# Altium schematic sheet ModuleConnectorB.SchDoc
size A portrait; DocumentNumber: 1; SheetNumber: 2; SheetTotal: 24
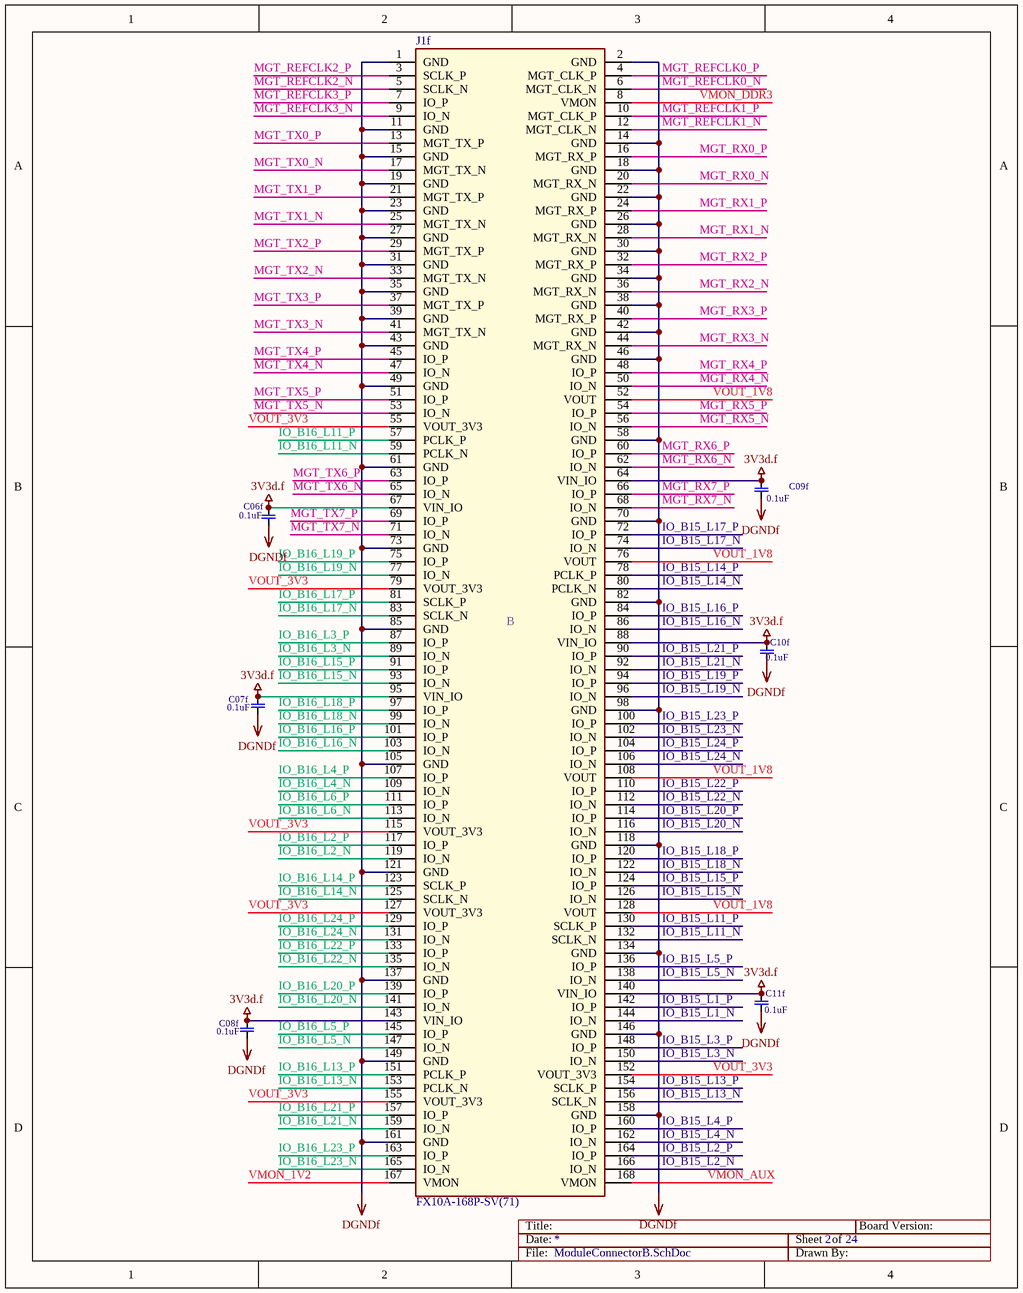
[diagram p0: ModuleConnectorB.SchDoc]

## Parts
C06f  0.1uF  [0603]
C07f  0.1uF  [0603]
C08f  0.1uF  [0603]
C09f  0.1uF  [0603]
C10f  0.1uF  [0603]
C11f  0.1uF  [0603]
J1f  FX10A-168P-SV(71)  [Mercury_Baseboard_Connector]

## Nets
3V3d.f: C06f.1 C07f.1 C08f.1 C09f.1 C10f.1 C11f.1 J1f.64(VIN_IO) J1f.67(VIN_IO) J1f.88(VIN_IO) J1f.95(VIN_IO) J1f.140(VIN_IO) J1f.143(VIN_IO)
DGNDf: C06f.2 C07f.2 C08f.2 C09f.2 C10f.2 C11f.2 J1f.1(GND) J1f.2(GND) J1f.11(GND) J1f.14(GND) J1f.15(GND) J1f.18(GND) J1f.19(GND) J1f.22(GND) J1f.23(GND) J1f.26(GND) J1f.27(GND) J1f.30(GND) J1f.31(GND) J1f.34(GND) J1f.35(GND) J1f.38(GND) J1f.39(GND) J1f.42(GND) J1f.43(GND) J1f.46(GND) J1f.49(GND) J1f.58(GND) J1f.61(GND) J1f.70(GND) J1f.73(GND) J1f.82(GND) J1f.85(GND) J1f.98(GND) J1f.105(GND) J1f.118(GND) J1f.121(GND) J1f.134(GND) J1f.137(GND) J1f.146(GND) J1f.149(GND) J1f.158(GND) J1f.161(GND)
IO_B15_L1_N: J1f.144(IO_N)
IO_B15_L1_P: J1f.142(IO_P)
IO_B15_L2_N: J1f.166(IO_N)
IO_B15_L2_P: J1f.164(IO_P)
IO_B15_L3_N: J1f.150(IO_N)
IO_B15_L3_P: J1f.148(IO_P)
IO_B15_L4_N: J1f.162(IO_N)
IO_B15_L4_P: J1f.160(IO_P)
IO_B15_L5_N: J1f.138(IO_N)
IO_B15_L5_P: J1f.136(IO_P)
IO_B15_L11_N: J1f.132(SCLK_N)
IO_B15_L11_P: J1f.130(SCLK_P)
IO_B15_L13_N: J1f.156(SCLK_N)
IO_B15_L13_P: J1f.154(SCLK_P)
IO_B15_L14_N: J1f.80(PCLK_N)
IO_B15_L14_P: J1f.78(PCLK_P)
IO_B15_L15_N: J1f.126(IO_N)
IO_B15_L15_P: J1f.124(IO_P)
IO_B15_L16_N: J1f.86(IO_N)
IO_B15_L16_P: J1f.84(IO_P)
IO_B15_L17_N: J1f.74(IO_N)
IO_B15_L17_P: J1f.72(IO_P)
IO_B15_L18_N: J1f.122(IO_N)
IO_B15_L18_P: J1f.120(IO_P)
IO_B15_L19_N: J1f.96(IO_N)
IO_B15_L19_P: J1f.94(IO_P)
IO_B15_L20_N: J1f.116(IO_N)
IO_B15_L20_P: J1f.114(IO_P)
IO_B15_L21_N: J1f.92(IO_N)
IO_B15_L21_P: J1f.90(IO_P)
IO_B15_L22_N: J1f.112(IO_N)
IO_B15_L22_P: J1f.110(IO_P)
IO_B15_L23_N: J1f.102(IO_N)
IO_B15_L23_P: J1f.100(IO_P)
IO_B15_L24_N: J1f.106(IO_N)
IO_B15_L24_P: J1f.104(IO_P)
IO_B16_L2_N: J1f.119(IO_N)
IO_B16_L2_P: J1f.117(IO_P)
IO_B16_L3_N: J1f.89(IO_N)
IO_B16_L3_P: J1f.87(IO_P)
IO_B16_L4_N: J1f.109(IO_N)
IO_B16_L4_P: J1f.107(IO_P)
IO_B16_L5_N: J1f.147(IO_N)
IO_B16_L5_P: J1f.145(IO_P)
IO_B16_L6_N: J1f.113(IO_N)
IO_B16_L6_P: J1f.111(IO_P)
IO_B16_L11_N: J1f.59(PCLK_N)
IO_B16_L11_P: J1f.57(PCLK_P)
IO_B16_L13_N: J1f.153(PCLK_N)
IO_B16_L13_P: J1f.151(PCLK_P)
IO_B16_L14_N: J1f.125(SCLK_N)
IO_B16_L14_P: J1f.123(SCLK_P)
IO_B16_L15_N: J1f.93(IO_N)
IO_B16_L15_P: J1f.91(IO_P)
IO_B16_L16_N: J1f.103(IO_N)
IO_B16_L16_P: J1f.101(IO_P)
IO_B16_L17_N: J1f.83(SCLK_N)
IO_B16_L17_P: J1f.81(SCLK_P)
IO_B16_L18_N: J1f.99(IO_N)
IO_B16_L18_P: J1f.97(IO_P)
IO_B16_L19_N: J1f.77(IO_N)
IO_B16_L19_P: J1f.75(IO_P)
IO_B16_L20_N: J1f.141(IO_N)
IO_B16_L20_P: J1f.139(IO_P)
IO_B16_L21_N: J1f.159(IO_N)
IO_B16_L21_P: J1f.157(IO_P)
IO_B16_L22_N: J1f.135(IO_N)
IO_B16_L22_P: J1f.133(IO_P)
IO_B16_L23_N: J1f.165(IO_N)
IO_B16_L23_P: J1f.163(IO_P)
IO_B16_L24_N: J1f.131(IO_N)
IO_B16_L24_P: J1f.129(IO_P)
MGT_REFCLK0_N: J1f.6(MGT_CLK_N)
MGT_REFCLK0_P: J1f.4(MGT_CLK_P)
MGT_REFCLK1_N: J1f.12(MGT_CLK_N)
MGT_REFCLK1_P: J1f.10(MGT_CLK_P)
MGT_REFCLK2_N: J1f.5(SCLK_N)
MGT_REFCLK2_P: J1f.3(SCLK_P)
MGT_REFCLK3_N: J1f.9(IO_N)
MGT_REFCLK3_P: J1f.7(IO_P)
MGT_RX0_N: J1f.20(MGT_RX_N)
MGT_RX0_P: J1f.16(MGT_RX_P)
MGT_RX1_N: J1f.28(MGT_RX_N)
MGT_RX1_P: J1f.24(MGT_RX_P)
MGT_RX2_N: J1f.36(MGT_RX_N)
MGT_RX2_P: J1f.32(MGT_RX_P)
MGT_RX3_N: J1f.44(MGT_RX_N)
MGT_RX3_P: J1f.40(MGT_RX_P)
MGT_RX4_N: J1f.50(IO_N)
MGT_RX4_P: J1f.48(IO_P)
MGT_RX5_N: J1f.56(IO_N)
MGT_RX5_P: J1f.54(IO_P)
MGT_RX6_N: J1f.62(IO_N)
MGT_RX6_P: J1f.60(IO_P)
MGT_RX7_N: J1f.68(IO_N)
MGT_RX7_P: J1f.66(IO_P)
MGT_TX0_N: J1f.17(MGT_TX_N)
MGT_TX0_P: J1f.13(MGT_TX_P)
MGT_TX1_N: J1f.25(MGT_TX_N)
MGT_TX1_P: J1f.21(MGT_TX_P)
MGT_TX2_N: J1f.33(MGT_TX_N)
MGT_TX2_P: J1f.29(MGT_TX_P)
MGT_TX3_N: J1f.41(MGT_TX_N)
MGT_TX3_P: J1f.37(MGT_TX_P)
MGT_TX4_N: J1f.47(IO_N)
MGT_TX4_P: J1f.45(IO_P)
MGT_TX5_N: J1f.53(IO_N)
MGT_TX5_P: J1f.51(IO_P)
MGT_TX6_N: J1f.65(IO_N)
MGT_TX6_P: J1f.63(IO_P)
MGT_TX7_N: J1f.71(IO_N)
MGT_TX7_P: J1f.69(IO_P)
VMON_1V2: J1f.167(VMON)
VMON_AUX: J1f.168(VMON)
VMON_DDR3: J1f.8(VMON)
VOUT_1V8: J1f.52(VOUT) J1f.76(VOUT) J1f.108(VOUT) J1f.128(VOUT)
VOUT_3V3: J1f.55(VOUT_3V3) J1f.79(VOUT_3V3) J1f.115(VOUT_3V3) J1f.127(VOUT_3V3) J1f.152(VOUT_3V3) J1f.155(VOUT_3V3)

## Notes on the sheet
- (near J1f) Title:
- (near J1f) Date:
- Sheet
- of
- Board Version:
- File:
- Drawn By:
- (in symbol Mercury_Baseboard_Connector-B) B

## Library data of the parts
C06f C07f C08f C09f C10f C11f = CAP
J1f = Mercury_Baseboard_Connector-B: Mercury Baseboard Connector; Manufacturer: Hirose; DistPartNumber: FX10A-168P-SV(71)-ND; Board_Variant: ALL; Check Sch: CG_2015-03-03; Enclustra PN: EN100374; Geometry.Height: 4mm stack height; Distributor: Digikey; Package: SMD - 168pin Hirose; ROHS: Yes; Characteristics: -; Supplier: Enclustra; Check PCB: -; Cost: 4.50; ManufPartNumber: FX10A-168P-SV(71); Temperature: -55..+85°C; Type: Connector; Value: FX10A-168P-SV(71)